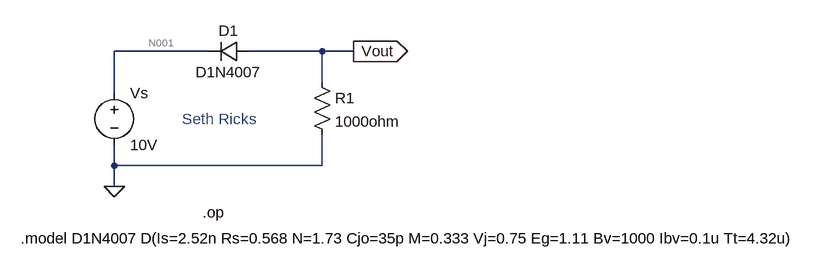
[diagram p0: schematic DiodesHW1part2.asc]
DiodesHW1part2.asc, the LTspice schematic file:
Version 4
SHEET 1 1216 680
WIRE 176 64 32 64
WIRE 352 64 240 64
WIRE 400 64 352 64
WIRE 352 112 352 64
WIRE 32 128 32 64
WIRE 32 240 32 208
WIRE 352 240 352 192
WIRE 352 240 32 240
WIRE 32 272 32 240
FLAG 32 272 0
FLAG 400 64 Vout
IOPIN 400 64 Out
SYMBOL voltage 32 112 R0
SYMATTR InstName Vs
SYMATTR Value 10V
SYMBOL diode 240 48 R90
WINDOW 0 0 32 VBottom 2
WINDOW 3 32 32 VTop 2
SYMATTR InstName D1
SYMATTR Value D1N4007
SYMBOL res 336 96 R0
SYMATTR InstName R1
SYMATTR Value 1000ohm
TEXT 136 168 Left 2 ;Seth Ricks
TEXT -112 352 Left 2 !.model D1N4007 D(Is=2.52n Rs=0.568 N=1.73 Cjo=35p M=0.333 Vj=0.75 Eg=1.11 Bv=1000 Ibv=0.1u Tt=4.32u)
TEXT 168 312 Left 2 !.op

The netlist it stands for:
* DiodesHW1part2.asc
Vs N001 0 10V
D1 Vout N001 D1N4007
R1 Vout 0 1000ohm
.model D D
.lib standard.dio
* Seth Ricks
.model D1N4007 D(Is=2.52n Rs=0.568 N=1.73 Cjo=35p M=0.333 Vj=0.75 Eg=1.11 Bv=1000 Ibv=0.1u Tt=4.32u)
.op
.backanno
.end

* Results of the author's LTspice run, read from the files saved beside the schematic
* Operating Point:
*   V(n001) = 10 V
*   V(vout) = 2.53 µV
*   I(D1) = -2.53 nA
*   I(R1) = 2.53 nA
*   I(Vs) = -2.53 nA
* From the log:
*   Semiconductor Device Operating Points:
*                           --- Diodes ---
*   Name:      d1
*   Model:   d1n4007
*   Id:     -2.53e-09
*   Vd:     -1.00e+01
*   Req:     1.00e+12
*   CAP:     1.44e-11